# EAGLE design miniDCU (EAGLE 9.6.2)
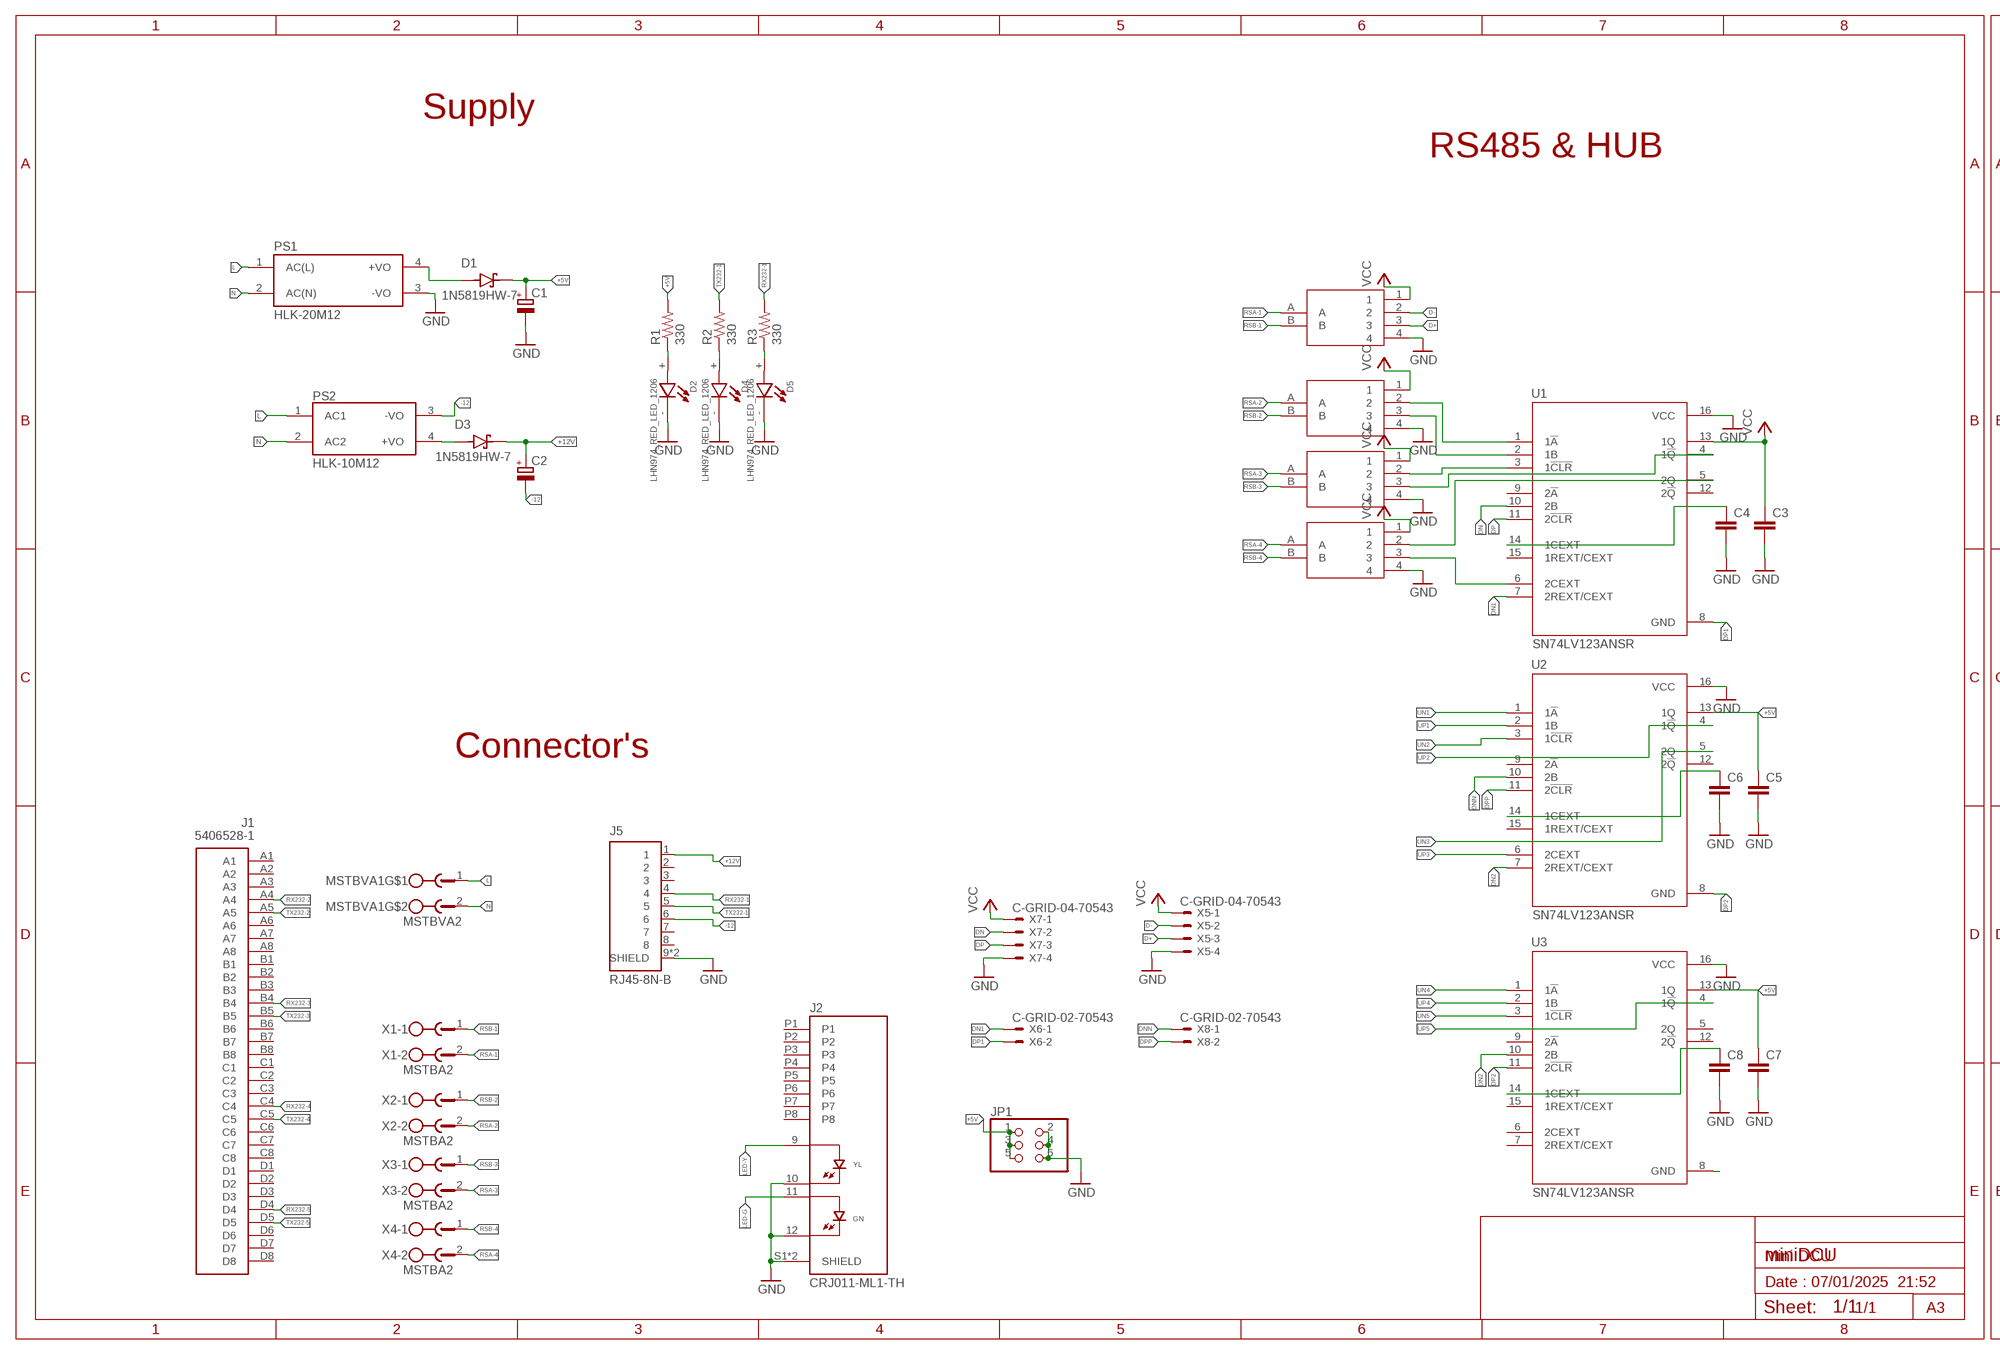
[diagram p0: schematic, sheet 1, part 1 of 2]
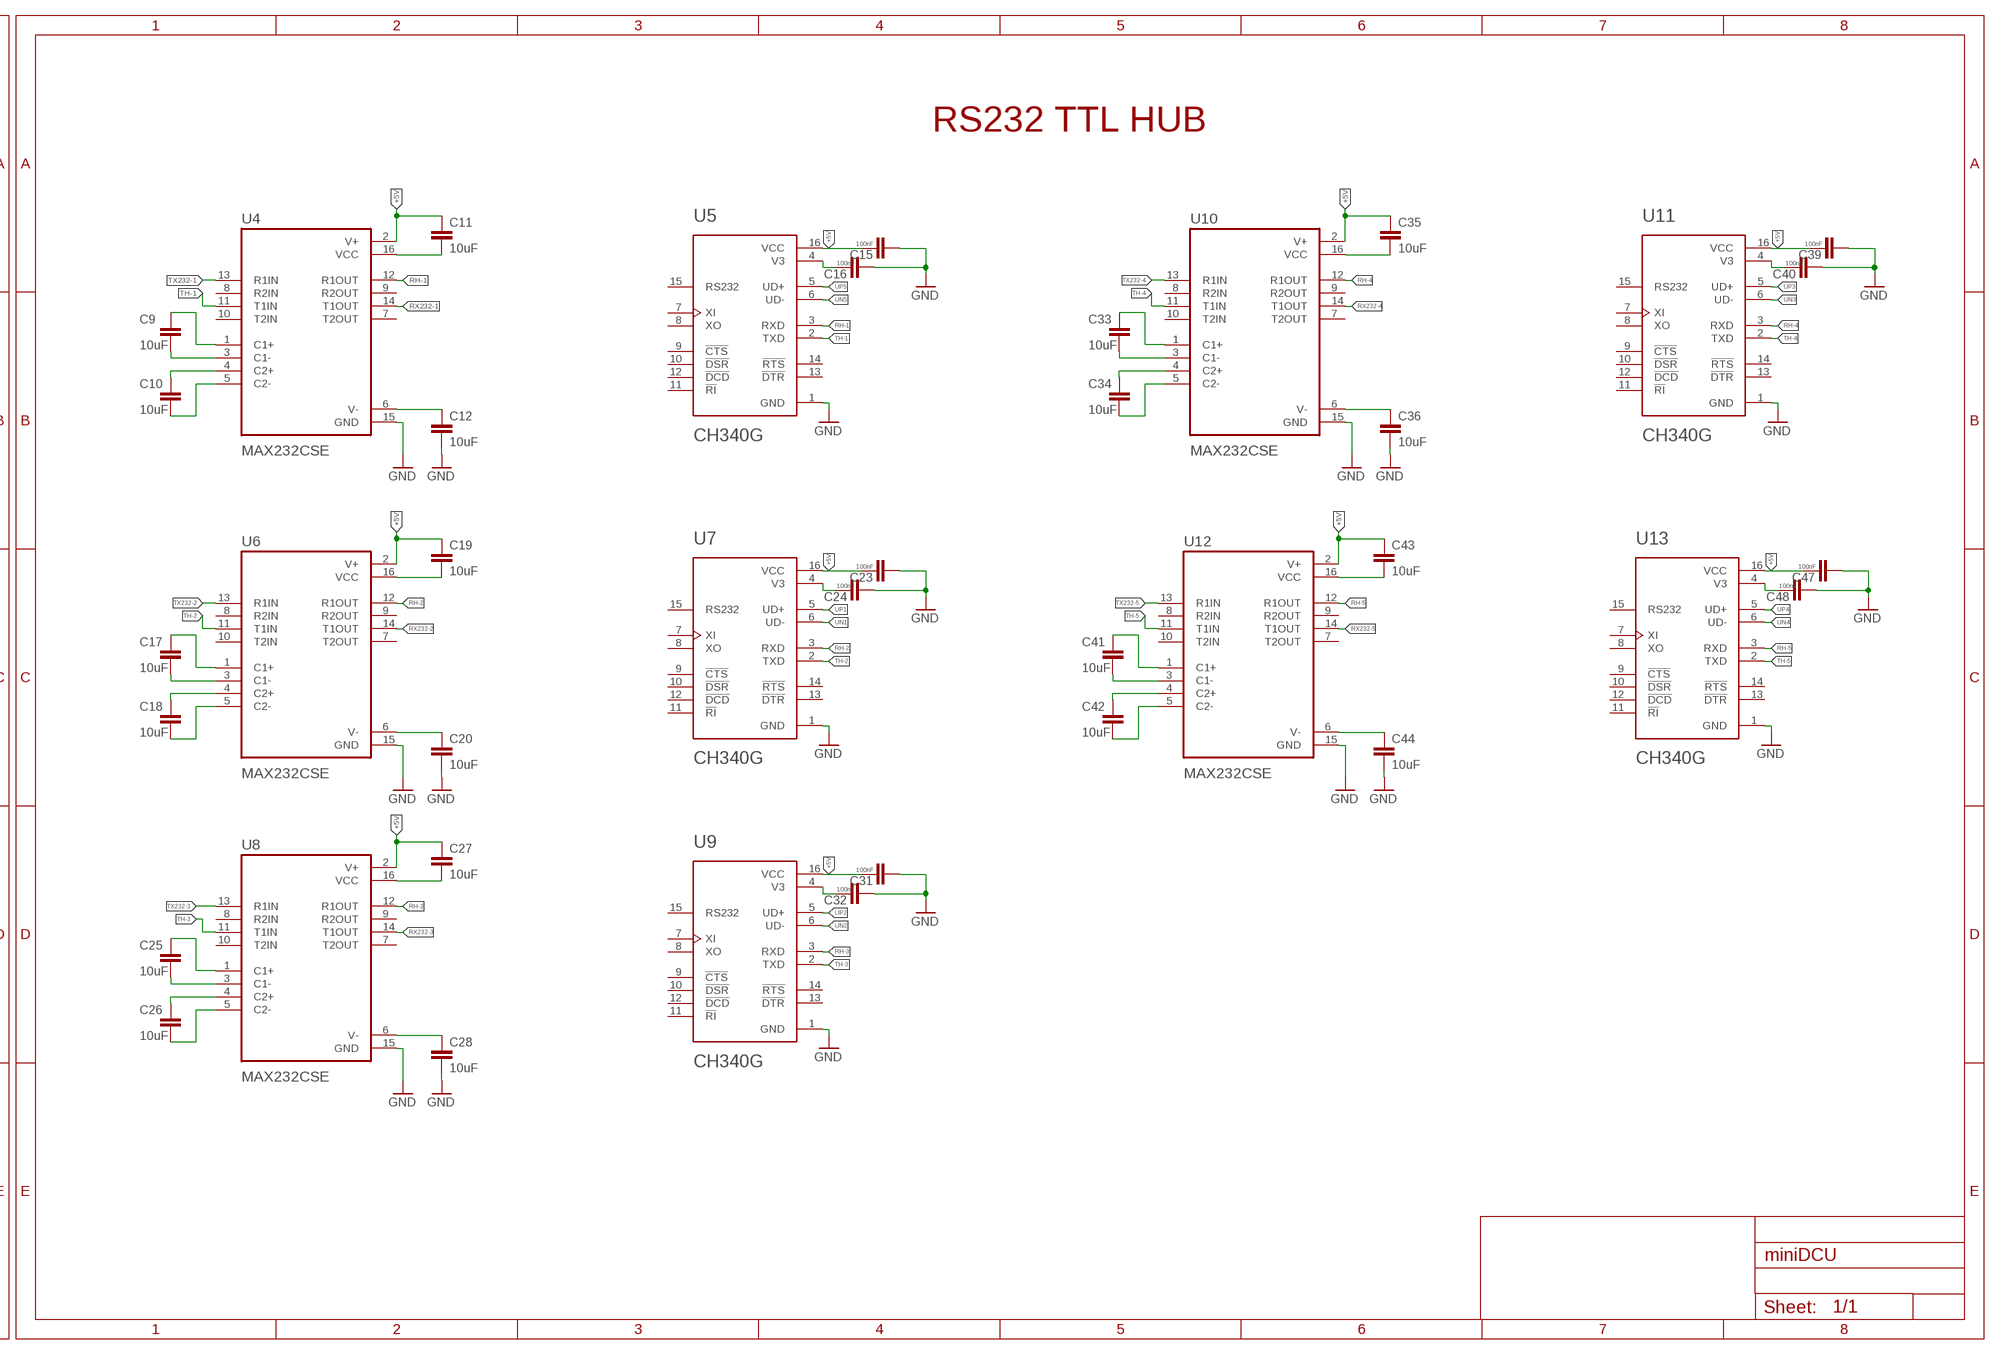
[diagram p1: schematic, sheet 1, part 2 of 2]

## Parts
C1  CPOL-EU153CLV-0505  [153CLV-0505]
C2  CPOL-EU153CLV-0505  [153CLV-0505]
C3  C-EUC0603K  [C0603K]
C4  C-EUC0603K  [C0603K]
C5  C-EUC0603K  [C0603K]
C6  C-EUC0603K  [C0603K]
C7  C-EUC0603K  [C0603K]
C8  C-EUC0603K  [C0603K]
C9  10uF  C-EUC0805  [C0805]
C10  10uF  C-EUC0805  [C0805]
C11  10uF  C-EUC0805  [C0805]
C12  10uF  C-EUC0805  [C0805]
C15  100nF  C-EUC0805K  [C0805K]
C16  100nF  C-EUC0805K  [C0805K]
C17  10uF  C-EUC0805  [C0805]
C18  10uF  C-EUC0805  [C0805]
C19  10uF  C-EUC0805  [C0805]
C20  10uF  C-EUC0805  [C0805]
C23  100nF  C-EUC0805K  [C0805K]
C24  100nF  C-EUC0805K  [C0805K]
C25  10uF  C-EUC0805  [C0805]
C26  10uF  C-EUC0805  [C0805]
C27  10uF  C-EUC0805  [C0805]
C28  10uF  C-EUC0805  [C0805]
C31  100nF  C-EUC0805K  [C0805K]
C32  100nF  C-EUC0805K  [C0805K]
C33  10uF  C-EUC0805  [C0805]
C34  10uF  C-EUC0805  [C0805]
C35  10uF  C-EUC0805  [C0805]
C36  10uF  C-EUC0805  [C0805]
C39  100nF  C-EUC0805K  [C0805K]
C40  100nF  C-EUC0805K  [C0805K]
C41  10uF  C-EUC0805  [C0805]
C42  10uF  C-EUC0805  [C0805]
C43  10uF  C-EUC0805  [C0805]
C44  10uF  C-EUC0805  [C0805]
C47  100nF  C-EUC0805K  [C0805K]
C48  100nF  C-EUC0805K  [C0805K]
D1  1N5819HW-7  [SOD3715X145N]
D2  LHN974_RED_LED_1206  [LEDC3216X120N]
D3  1N5819HW-7  [SOD3715X145N]
D4  LHN974_RED_LED_1206  [LEDC3216X120N]
D5  LHN974_RED_LED_1206  [LEDC3216X120N]
J1  5406528-1  [5406528-1]
J2  CRJ011-ML1-TH  [CUI_CRJ011-ML1-TH]
J5  RJ45-8N-B  [TE_RJ45-8N-B]
JP1  PINHD-2X3  [2X03]
MSTBVA1  MSTBVA2  [MSTBVA2]
PS1  HLK-20M12  [CONV_HLK-20M12]
PS2  HLK-10M12  [CONV_HLK-10M12]
R1  330  R-US_M0805  [M0805]
R2  330  R-US_M0805  [M0805]
R3  330  R-US_M0805  [M0805]
U1  SN74LV123ANSR  [SOIC127P780X200-16N]
U2  SN74LV123ANSR  [SOIC127P780X200-16N]
U3  SN74LV123ANSR  [SOIC127P780X200-16N]
U4  MAX232CSE  [SOIC127P600X175-16N]
U5  CH340G  [SOIC127P600X180-16N]
U6  MAX232CSE  [SOIC127P600X175-16N]
U7  CH340G  [SOIC127P600X180-16N]
U8  MAX232CSE  [SOIC127P600X175-16N]
U9  CH340G  [SOIC127P600X180-16N]
U10  MAX232CSE  [SOIC127P600X175-16N]
U11  CH340G  [SOIC127P600X180-16N]
U12  MAX232CSE  [SOIC127P600X175-16N]
U13  CH340G  [SOIC127P600X180-16N]
USB2RS1  USB2RS485  [USB2RS485]
USB2RS2  USB2RS485  [USB2RS485]
USB2RS3  USB2RS485  [USB2RS485]
USB2RS5  USB2RS485  [USB2RS485]
X1  MSTBA2  [MSTBA2]
X2  MSTBA2  [MSTBA2]
X3  MSTBA2  [MSTBA2]
X4  MSTBA2  [MSTBA2]
X5  C-GRID-04-70543  [70543-04]
X6  C-GRID-02-70543  [70543-02]
X7  C-GRID-04-70543  [70543-04]
X8  C-GRID-02-70543  [70543-02]

## Nets
+5V: C1.+ C5.1 C7.1 C11.1 C15.1 C19.1 C23.1 C27.1 C31.1 C35.1 C39.1 C43.1 C47.1 D1.C(K) JP1.1 JP1.3 JP1.5 R1.2 U2.13(1Q) U3.13(1Q) U4.2(V+) U5.16(VCC) U6.2(V+) U7.16(VCC) U8.2(V+) U9.16(VCC) U10.2(V+) U11.16(VCC) U12.2(V+) U13.16(VCC)
+12V: C2.+ D3.C(K) J5.1
-12: C2.- J5.6 PS2.3(-VO)
D+: USB2RS5.3 X5.3
D-: USB2RS5.2 X5.2
DN: U1.10(2B) X7.2
DN1: U1.7(2REXT/CEXT) X6.1
DN2: U2.7(2REXT/CEXT) U3.10(2B)
DNN: U2.10(2B) X8.1
DP: U1.11(2!CLR) X7.3
DP1: U1.8(GND) X6.2
DP2: U2.8(GND) U3.11(2!CLR)
DPP: U2.11(2!CLR) X8.2
GND: C1.- C3.2 C4.2 C5.2 C6.2 C7.2 C8.2 C12.2 C15.2 C16.2 C20.2 C23.2 C24.2 C28.2 C31.2 C32.2 C36.2 C39.2 C40.2 C44.2 C47.2 C48.2 D2.- D4.- D5.- J2.10 J2.12 J2.S1(SHIELD) J2.S2(SHIELD) J5.9(SHIELD) J5.10(SHIELD) JP1.2 JP1.4 JP1.6 PS1.3(-VO) U1.16(VCC) U2.16(VCC) U3.16(VCC) U4.15(GND) U5.1(GND) U6.15(GND) U7.1(GND) U8.15(GND) U9.1(GND) U10.15(GND) U11.1(GND) U12.15(GND) U13.1(GND) USB2RS1.4 USB2RS2.4 USB2RS3.4 USB2RS5.4 X5.4 X7.4
L: MSTBVA1.1 PS1.1(AC(L)) PS2.1(AC1)
LED-G: J2.11
LED-Y: J2.9
N: MSTBVA1.2 PS1.2(AC(N)) PS2.2(AC2)
N$1: D1.A PS1.4(+VO)
N$2: D4.+ R2.1
N$3: D2.+ R1.1
N$4: D5.+ R3.1
N$8: D3.A PS2.4(+VO)
N$13: U3.8(GND)
N$14: C9.2 U4.3(C1-)
N$15: C9.1 U4.1(C1+)
N$16: C10.1 U4.4(C2+)
N$17: C10.2 U4.5(C2-)
N$18: C11.2 U4.16(VCC)
N$19: C12.1 U4.6(V-)
N$21: U1.1(1!A) USB2RS1.2
N$22: U1.2(1B) USB2RS1.3
N$23: U1.3(1!CLR) USB2RS2.2
N$24: U1.4(1!Q) USB2RS2.3
N$25: U1.5(2Q) USB2RS3.2
N$26: U1.6(2CEXT) USB2RS3.3
N$27: C16.1 U5.4(V3)
N$29: C17.2 U6.3(C1-)
N$30: C17.1 U6.1(C1+)
N$31: C18.1 U6.4(C2+)
N$32: C18.2 U6.5(C2-)
N$33: C19.2 U6.16(VCC)
N$34: C20.1 U6.6(V-)
N$39: C24.1 U7.4(V3)
N$41: C25.2 U8.3(C1-)
N$42: C25.1 U8.1(C1+)
N$43: C26.1 U8.4(C2+)
N$44: C26.2 U8.5(C2-)
N$45: C27.2 U8.16(VCC)
N$46: C28.1 U8.6(V-)
N$49: C32.1 U9.4(V3)
N$51: C33.2 U10.3(C1-)
N$52: C33.1 U10.1(C1+)
N$53: C34.1 U10.4(C2+)
N$54: C4.1 U1.14(1CEXT)
N$55: C8.1 U3.14(1CEXT)
N$56: C34.2 U10.5(C2-)
N$57: C35.2 U10.16(VCC)
N$58: C36.1 U10.6(V-)
N$61: C6.1 U2.14(1CEXT)
N$62: C40.1 U11.4(V3)
N$64: C41.2 U12.3(C1-)
N$65: C41.1 U12.1(C1+)
N$66: C42.1 U12.4(C2+)
N$67: C42.2 U12.5(C2-)
N$68: C43.2 U12.16(VCC)
N$69: C44.1 U12.6(V-)
N$72: C48.1 U13.4(V3)
RH-1: U4.12(R1OUT) U5.3(RXD)
RH-2: U6.12(R1OUT) U7.3(RXD)
RH-3: U8.12(R1OUT) U9.3(RXD)
RH-4: U10.12(R1OUT) U11.3(RXD)
RH-5: U12.12(R1OUT) U13.3(RXD)
RSA-1: USB2RS5.A X1.2
RSA-2: USB2RS1.A X2.2
RSA-3: USB2RS2.A X3.2
RSA-4: USB2RS3.A X4.2
RSB-1: USB2RS5.B X1.1
RSB-2: USB2RS1.B X2.1
RSB-3: USB2RS2.B X3.1
RSB-4: USB2RS3.B X4.1
RX232-1: J5.4 R3.2 U4.14(T1OUT)
RX232-2: J1.A4 U6.14(T1OUT)
RX232-3: J1.B4 U8.14(T1OUT)
RX232-4: J1.C4 U10.14(T1OUT)
RX232-5: J1.D4 U12.14(T1OUT)
TH-1: U4.11(T1IN) U5.2(TXD)
TH-2: U6.11(T1IN) U7.2(TXD)
TH-3: U8.11(T1IN) U9.2(TXD)
TH-4: U10.11(T1IN) U11.2(TXD)
TH-5: U12.11(T1IN) U13.2(TXD)
TX232-1: J5.5 R2.2 U4.13(R1IN)
TX232-2: J1.A5 U6.13(R1IN)
TX232-3: J1.B5 U8.13(R1IN)
TX232-4: J1.C5 U10.13(R1IN)
TX232-5: J1.D5 U12.13(R1IN)
UN1: U2.1(1!A) U7.6(UD-)
UN2: U2.3(1!CLR) U9.6(UD-)
UN3: U2.5(2Q) U11.6(UD-)
UN4: U3.1(1!A) U13.6(UD-)
UN5: U3.3(1!CLR) U5.6(UD-)
UP1: U2.2(1B) U7.5(UD+)
UP2: U2.4(1!Q) U9.5(UD+)
UP3: U2.6(2CEXT) U11.5(UD+)
UP4: U3.2(1B) U13.5(UD+)
UP5: U3.4(1!Q) U5.5(UD+)
VCC: C3.1 U1.13(1Q) USB2RS1.1 USB2RS2.1 USB2RS3.1 USB2RS5.1 X5.1 X7.1
Unconnected: J1.A1 J1.A2 J1.A3 J1.A6 J1.A7 J1.A8 J1.B1 J1.B2 J1.B3 J1.B6 J1.B7 J1.B8 J1.C1 J1.C2 J1.C3 J1.C6 J1.C7 J1.C8 J1.D1 J1.D2 J1.D3 J1.D6 J1.D7 J1.D8 J2.P1 J2.P2 J2.P3 J2.P4 J2.P5 J2.P6 J2.P7 J2.P8 J5.2 J5.3 J5.7 J5.8 U1.9(2!A) U1.12(2!Q) U1.15(1REXT/CEXT) U2.9(2!A) U2.12(2!Q) U2.15(1REXT/CEXT) U3.5(2Q) U3.6(2CEXT) U3.7(2REXT/CEXT) U3.9(2!A) U3.12(2!Q) U3.15(1REXT/CEXT) U4.7(T2OUT) U4.8(R2IN) U4.9(R2OUT) U4.10(T2IN) U5.7(XI) U5.8(XO) U5.9(!CTS) U5.10(!DSR) U5.11(!RI) U5.12(!DCD) U5.13(!DTR) U5.14(!RTS) U5.15(RS232) U6.7(T2OUT) U6.8(R2IN) U6.9(R2OUT) U6.10(T2IN) U7.7(XI) U7.8(XO) U7.9(!CTS) U7.10(!DSR) U7.11(!RI) U7.12(!DCD) U7.13(!DTR) U7.14(!RTS) U7.15(RS232) U8.7(T2OUT) U8.8(R2IN) U8.9(R2OUT) U8.10(T2IN) U9.7(XI) U9.8(XO) U9.9(!CTS) U9.10(!DSR) U9.11(!RI) U9.12(!DCD) U9.13(!DTR) U9.14(!RTS) U9.15(RS232) U10.7(T2OUT) U10.8(R2IN) U10.9(R2OUT) U10.10(T2IN) U11.7(XI) U11.8(XO) U11.9(!CTS) U11.10(!DSR) U11.11(!RI) U11.12(!DCD) U11.13(!DTR) U11.14(!RTS) U11.15(RS232) U12.7(T2OUT) U12.8(R2IN) U12.9(R2OUT) U12.10(T2IN) U13.7(XI) U13.8(XO) U13.9(!CTS) U13.10(!DSR) U13.11(!RI) U13.12(!DCD) U13.13(!DTR) U13.14(!RTS) U13.15(RS232)

## Notes on the sheet
- Supply
- RS232 TTL HUB
- RS485 & HUB
- Connector's
- Mini DCU
- Date : 07/01/2025  21:52
- 1/1 | A3

## Library data of the parts
C1 C2 = rcl:CPOL-EU: POLARIZED CAPACITOR, European symbol; SPICEPREFIX: C
C3-C12 C15-C20 C23-C28 C31-C36 C39-C44 C47 C48 = rcl:C-EU: CAPACITOR, European symbol; SPICEPREFIX: C
D1 D3 = 1N5819HW-7:1N5819HW-7: 1N5819HW Series 40 V 1 A Surface Mount Schottky Barrier Rectifier - SOD-123 Check availability <https://pricing.snapeda.com/parts/1N5819HW-7/Diodes%20Inc./view-part?ref=eda>; AVAILABILITY: In Stock; DESCRIPTION: Diode Schottky 40 V 1A Surface Mount SOD-123; MF: Diodes Inc.; MP: 1N5819HW-7; PACKAGE: SOD-123 Fairchild Semiconductor; PRICE: None; PURCHASE-URL: https://pricing.snapeda.com/search/part/1N5819HW-7/?ref=eda
D2 D4 D5 = LHN974_RED_LED_1206:LHN974_RED_LED_1206: Check availability <https://pricing.snapeda.com/parts/LHN974%20RED%20LED%201206/Osram/view-part?ref=eda>; AVAILABILITY: Not in stock; CHECK_PRICES: https://www.snapeda.com/parts/LHN974%20RED%20LED%201206/Osram/view-part/?ref=eda; DESCRIPTION: 2.6 V Red LED SMD; MF: Osram; MP: LHN974 RED LED 1206; PACKAGE: None; PRICE: None; SNAPEDA_LINK: https://www.snapeda.com/parts/LHN974%20RED%20LED%201206/Osram/view-part/?ref=snap
J1 = 1x4-rj45:5406528-1: https://www.mouser.com/ProductDetail/TE-Connectivity/5406528-1?qs=%2Fha2pyFaduhW1yoX2fqnO8wde0gPlB9ihmIbWroxuIA%3D Check availability <https://pricing.snapeda.com/parts/5406528-1/TE%20Connectivity/view-part?ref=eda>; AVAILABILITY: In Stock; CHECK_PRICES: https://www.snapeda.com/parts/5406528-1/TE+Connectivity+AMP+Connectors/view-part/?ref=eda; COMMENT: 5406528-1; DESCRIPTION: Conn RJ-45 F 32 POS 2.04mm Solder RA Thru-Hole 32 Terminal 4 Port Tray Cat 5; EU_ROHS_COMPLIANCE: Compliant; MF: TE Connectivity; MP: 5406528-1; PACKAGE: None; PRICE: None; SNAPEDA_LINK: https://www.snapeda.com/parts/5406528-1/TE+Connectivity+AMP+Connectors/view-part/?ref=snap
J2 = CRJ011-ML1-TH:CRJ011-ML1-TH: Check availability <https://pricing.snapeda.com/parts/CRJ011-ML1-TH/Same%20Sky/view-part?ref=eda>; AVAILABILITY: In Stock; CHECK_PRICES: https://www.snapeda.com/parts/CRJ011-ML1-TH/Same+Sky/view-part/?ref=eda; DESCRIPTION: 10/100 BaseT, 8P8C, Horizontal, Shielded, LED, Through Hole, 6 µin Plating, RJ45 with Integrated Magnetics Modular Connector; MF: Same Sky; MP: CRJ011-ML1-TH; PACKAGE: None; PRICE: None; SNAPEDA_LINK: https://www.snapeda.com/parts/CRJ011-ML1-TH/Same+Sky/view-part/?ref=snap
J5 = RJ45-8N-B:RJ45-8N-B: RJ Jack / Signal Line EMI/RFI Filters 6 TERM LOW PROFILE BLOCK INDUCTOR 8 PIN Check availability <https://pricing.snapeda.com/parts/RJ45-8N-B/TE%20Connectivity/view-part?ref=eda>; AVAILABILITY: In Stock; DESCRIPTION: Jack Modular Connector 8p8c (RJ45, Ethernet) 90° Angle (Right) Unshielded -; MF: TE Connectivity; MP: RJ45-8N-B; PACKAGE: None; PRICE: None; PURCHASE-URL: https://pricing.snapeda.com/search/part/RJ45-8N-B/?ref=eda
JP1 = pinhead:PINHD-2X3: PIN HEADER
MSTBVA1 = con-phoenix-508:MSTBVA2
PS1 = HLK-20M12:HLK-20M12: Check availability <https://pricing.snapeda.com/parts/HLK-20M12/Hi-link/view-part?ref=eda>; AVAILABILITY: Not in stock; CHECK_PRICES: https://www.snapeda.com/parts/HLK-20M12/Hi-link/view-part/?ref=eda; DESCRIPTION: 20W ultra-small series module power supply; MF: Hi-link; MP: HLK-20M12; PACKAGE: Non-Standard Hi-link; PRICE: None; SNAPEDA_LINK: https://www.snapeda.com/parts/HLK-20M12/Hi-link/view-part/?ref=snap
PS2 = HLK-10M12:HLK-10M12: Check availability <https://pricing.snapeda.com/parts/HLK-10M12/Hi-link/view-part?ref=eda>; AVAILABILITY: Not in stock; CHECK_PRICES: https://www.snapeda.com/parts/HLK-10M12/Hi-link/view-part/?ref=eda; DESCRIPTION: 10W Ultra-Compact Power Module; MF: Hi-link; MP: HLK-10M12; PACKAGE: Package; PRICE: None; SNAPEDA_LINK: https://www.snapeda.com/parts/HLK-10M12/Hi-link/view-part/?ref=snap
R1-R3 = adafruit:R-US_: RESISTOR, American symbol
U1-U3 = SN74LV123ANSR:SN74LV123ANSR: Monostable Multivibrator 13ns 16-SO; CHECK_PRICES: https://www.snapeda.com/parts/SN74LV123ANSR/Texas+Instruments/view-part/?ref=eda; DESCRIPTION: Dual Retriggerable Monostable Multivibrators; DIGIKEY_PART_NUMBER: 296-46201-2-ND; MF: Texas Instruments; MP: SN74LV123ANSR; PACKAGE: SOP-16 Texas Instruments; SNAPEDA_LINK: https://www.snapeda.com/parts/SN74LV123ANSR/Texas+Instruments/view-part/?ref=snap
U4 U6 U8 U10 U12 = MAX232CSE:MAX232CSE: Check availability <https://pricing.snapeda.com/parts/MAX232CSE/Maxim%20Integrated/view-part?ref=eda>; AVAILABILITY: In Stock; DESCRIPTION: 2/2 Transceiver Full RS232 16-SOIC; MF: Maxim Integrated; MP: MAX232CSE; PACKAGE: SOIC-16 Maxim Integrated; PRICE: None; PURCHASE-URL: https://pricing.snapeda.com/search/part/MAX232CSE/?ref=eda
U5 U7 U9 U11 U13 = CH340G:CH340G: Check availability <https://pricing.snapeda.com/parts/Ch340G/WCH/view-part?ref=eda>; AVAILABILITY: Not in stock; DESCRIPTION: USB Interface Integrated Circuit; MF: WCH; MP: Ch340G; PACKAGE: None; PRICE: None
USB2RS1-USB2RS3 USB2RS5 = USB2RS485:USB2RS485
X1-X4 = con-phoenix-508:MSTBA2: PHOENIX; MF: FARNELL; MPN: 1757242; OC_FARNELL: 3705171; OC_NEWARK: 71C4161
X5 X7 = con-molex:C-GRID-04: CONNECTOR wire to board 2.54 mm (0.100") pitch header; MF: MOLEX; OC_FARNELL: unknown; OC_NEWARK: unknown
X6 X8 = con-molex:C-GRID-02: CONNECTOR wire to board 2.54 mm (0.100") pitch header; MF: MOLEX; OC_FARNELL: unknown; OC_NEWARK: unknown

## Board
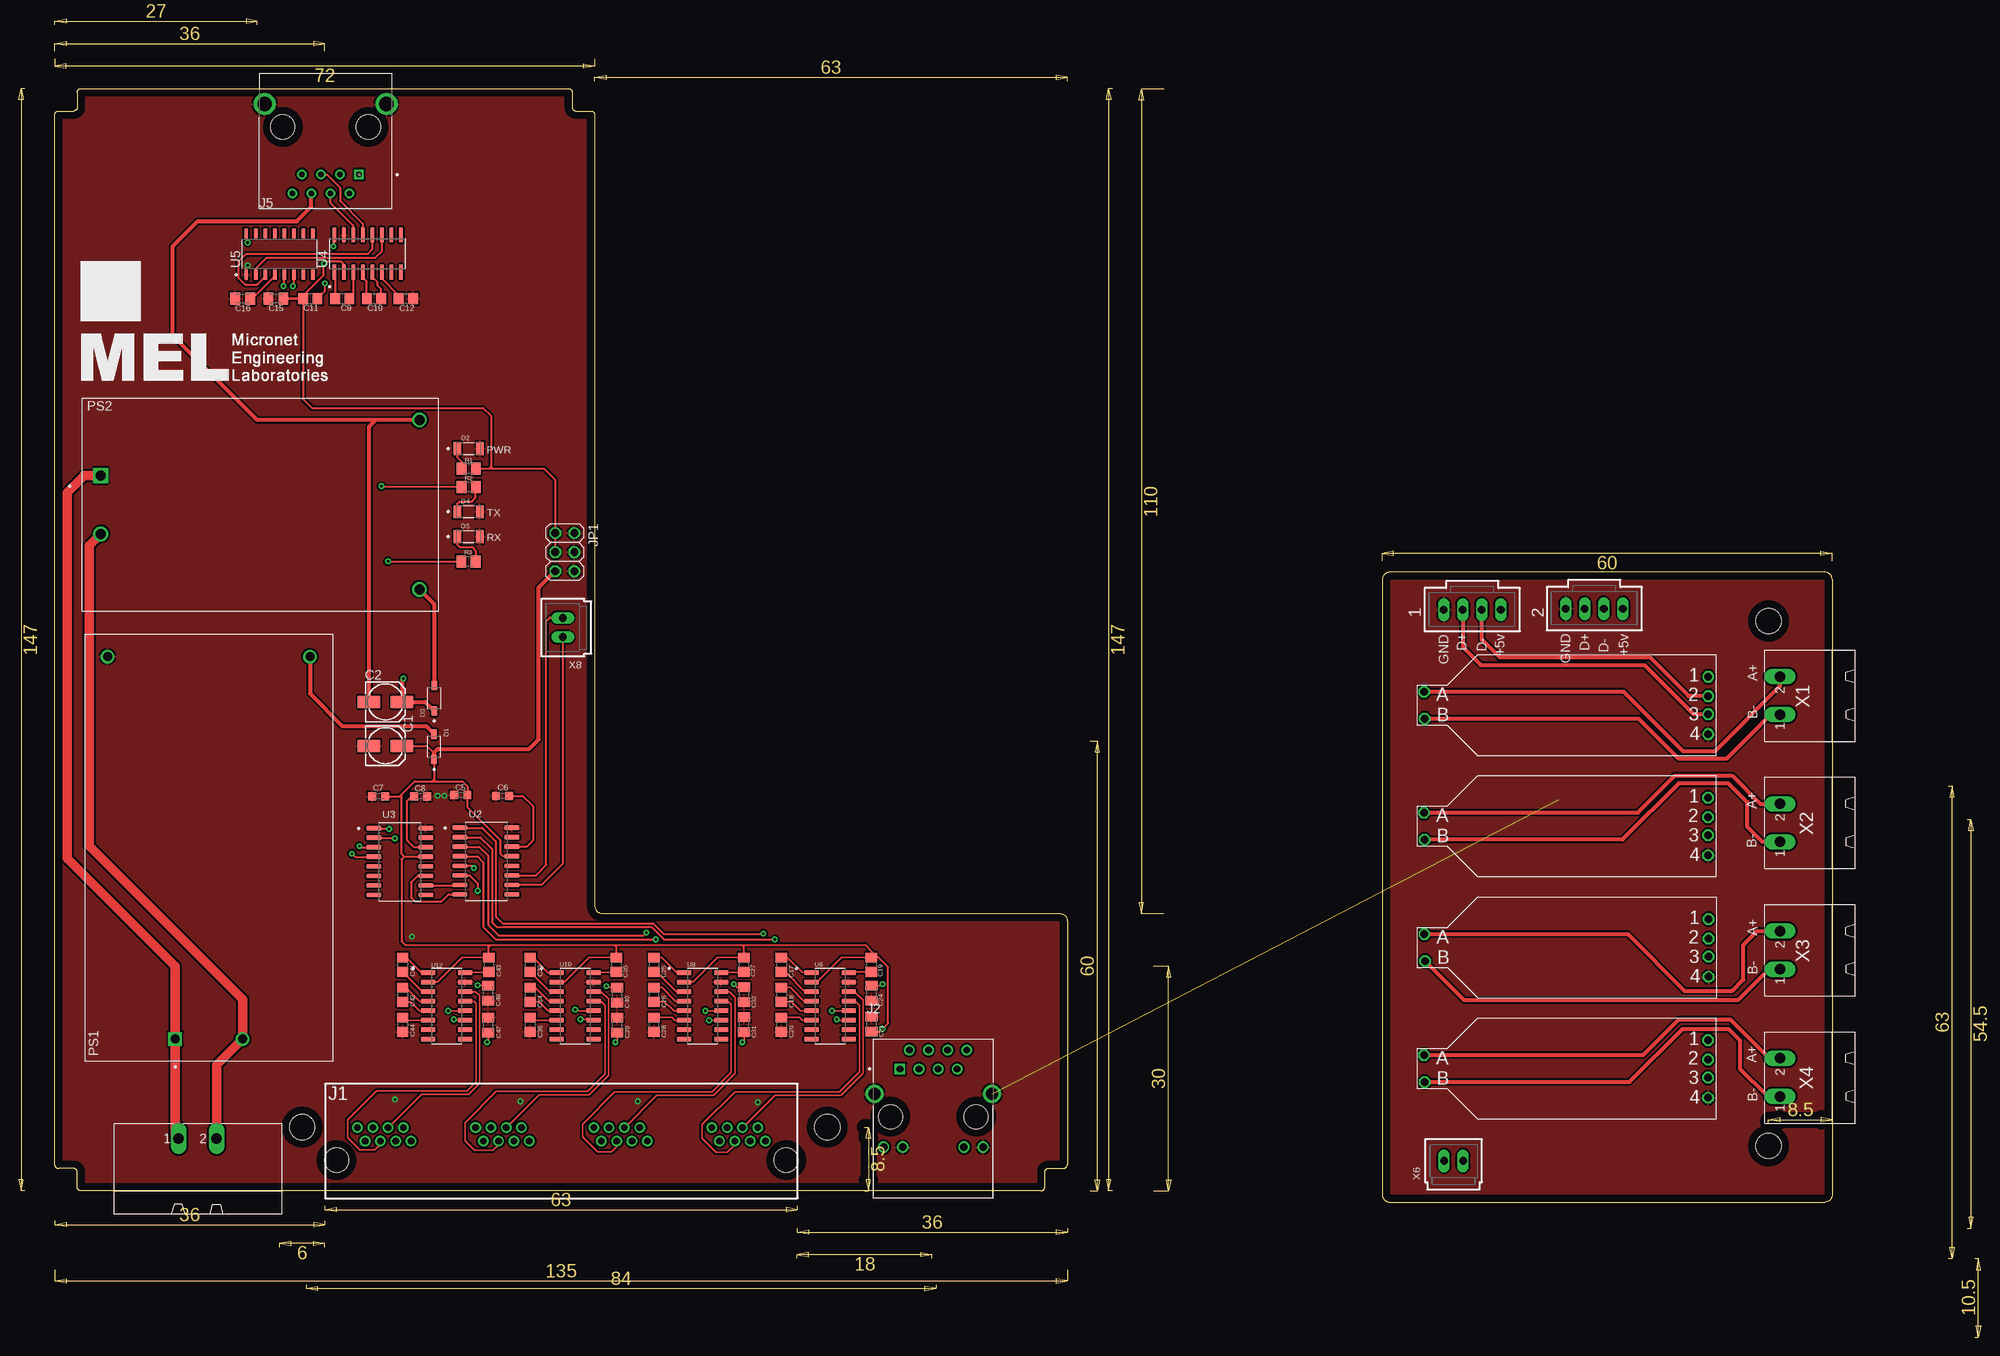
[diagram p2: board, top side]
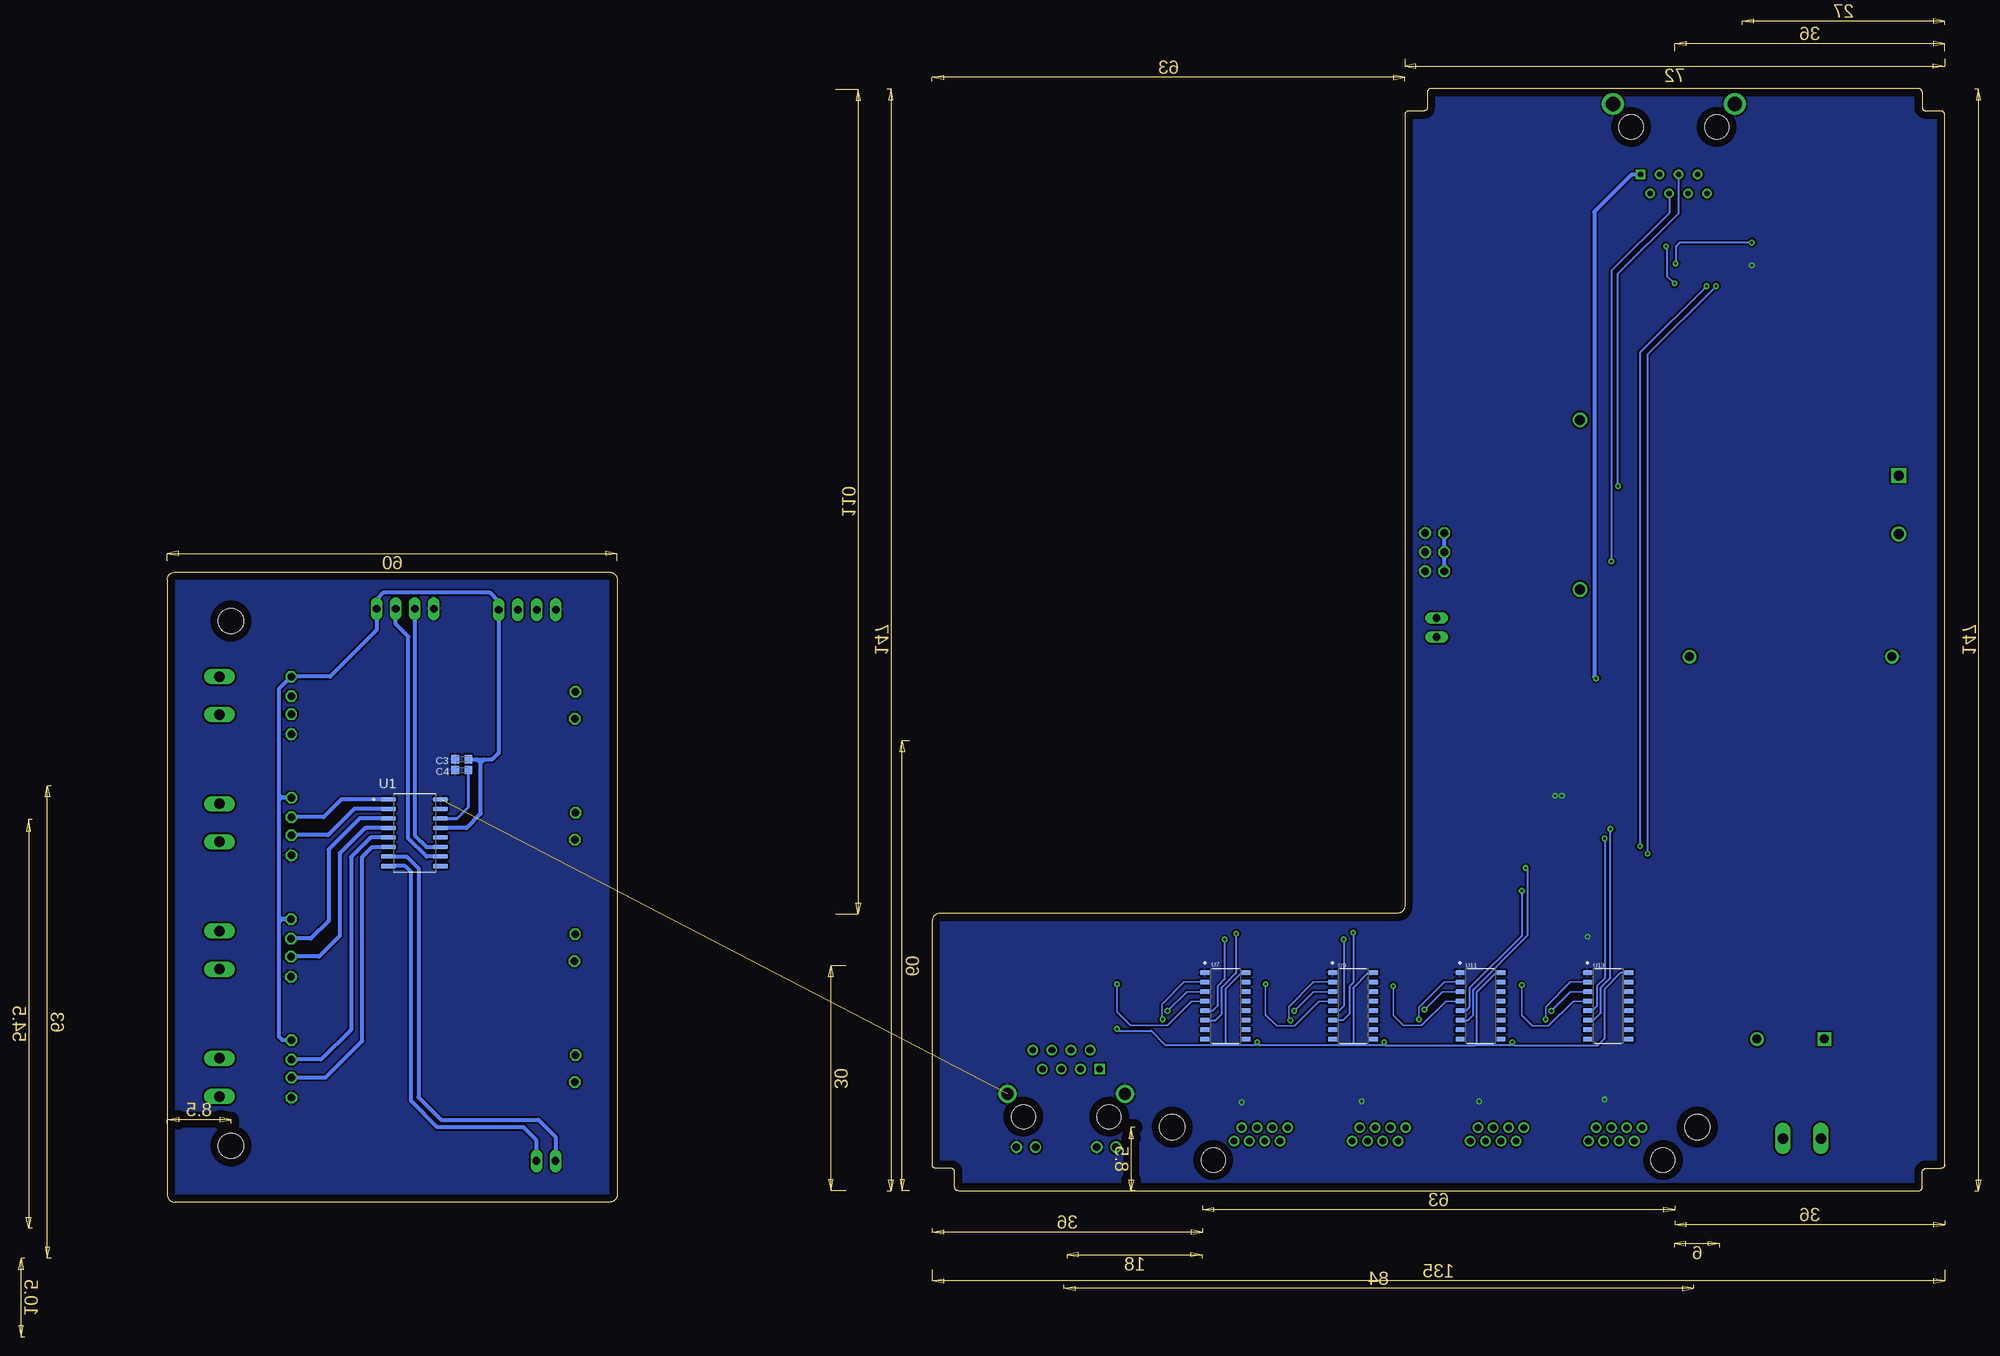
[diagram p3: board, bottom side, seen from below]

Size 237 x 148.5 mm. Coordinates in mm from the lower left corner, seen from the top.
Outline: 237,83 237,1 arc-90 236,0 178,0 arc-90 177,1 177,83 arc-90 178,84 236,84 arc-90 237,83
Outline: 0,5 0,145 arc-90 0.5,145.5 2.5,145.5 arc90 3,146 3,148 arc-90 3.5,148.5 68.5,148.5 arc-90 69,148 69,146 arc90 69.5,145.5 71.5,145.5 arc-90 72,145 72,39.5 arc90 73,38.5 134,38.5 arc-90 135,37.5 135,5 arc-90 134.5,4.5 132.5,4.5 arc90 132,4 132,2 arc-90 131.5,1.5 3.5,1.5 arc-90 3,2 3,4 arc90 2.5,4.5 0.5,4.5 arc-90 0,5
Copper layers (1*16): Top 0.035mm / dielectric 1.5mm / Bottom 0.035mm
Design rules "miniDCU *": minimum track width 6mil, minimum drill 0.35mm, track to track 10mil, track to pad 10mil, pad to pad 0.205mm, via to via 0.205mm, smd to smd 6mil, copper to edge 40mil, drill to drill 6mil, minimum pad ring 10mil, minimum via ring 8mil, stop-mask expansion 4mil, vias tented up to drill 0mil, thermal gap 10mil
Holes 3.4 mm at 33,10 103,10 228.5,7.5 228.5,77.5

### Footprints (pad centres in the part's own frame; a part is rotated, then mirrored left to right if it is on the bottom)
153CLV-0505 = smd 3 x 1.6: + 2.2,0; - -2.2,0
C0603K = smd 1.05 x 1.08: 1 -0.875,0; 2 0.875,0
C0805 = smd 1.3 x 1.5: 1 -0.95,0; 2 0.95,0
C0805K = smd 1.3 x 1.6: 1 -1,0; 2 1,0
SOD3715X145N = smd 1.21 x 0.73: A 1.68,0; C -1.68,0
LEDC3216X120N = smd 1.01 x 1.73: + -1.51,0; - 1.51,0
5406528-1 = drill 0.9 pad 1.3: A1 27.21,7.62; A2 26.19,9.4; A3 25.17,7.62; A4 24.15,9.4; A5 23.13,7.62; A6 22.11,9.4; A7 21.09,7.62; A8 20.07,9.4; B1 11.46,7.62; B2 10.44,9.4; B3 9.42,7.62; B4 8.4,9.4; B5 7.38,7.62; B6 6.36,9.4; B7 5.34,7.62; B8 4.32,9.4; C1 -4.29,7.62; C2 -5.31,9.4; C3 -6.33,7.62; C4 -7.35,9.4; C5 -8.37,7.62; C6 -9.39,9.4; C7 -10.41,7.62; C8 -11.43,9.4; D1 -20.04,7.62; D2 -21.06,9.4; D3 -22.08,7.62; D4 -23.1,9.4; D5 -24.12,7.62; D6 -25.14,9.4; D7 -26.16,7.62; D8 -27.18,9.4 | hole 3.25: -29.97,5.08; 29.97,5.08
CUI_CRJ011-ML1-TH = drill 1: 9 -6.63,-4.06; 10 -4.09,-4.06; 11 4.09,-4.06; 12 6.63,-4.06 | drill 0.9 square: P1 -4.445,6.35 | drill 0.9: P2 -3.175,8.89; P3 -1.905,6.35; P4 -0.635,8.89; P5 0.635,6.35; P6 1.905,8.89; P7 3.175,6.35; P8 4.445,8.89 | drill 1.6: S1 -7.815,3.05; S2 7.815,3.05 | hole 3.25: -5.715,0; 5.715,0
TE_RJ45-8N-B = drill 0.76 square: 1 -4.445,6.35 | drill 0.76: 2 -3.175,8.89; 3 -1.905,6.35; 4 -0.635,8.89; 5 0.635,6.35; 6 1.905,8.89; 7 3.175,6.35; 8 4.445,8.89 | drill 1.93: 9 -8.125,-3.05; 10 8.125,-3.05 | hole 3.25: -5.715,0; 5.715,0
2X03 = drill 1.016 octagon: 1 -2.54,-1.27; 2 -2.54,1.27; 3 0,-1.27; 4 0,1.27; 5 2.54,-1.27; 6 2.54,1.27
MSTBVA2 = drill 1.397 long: 1 -2.54,5.08; 2 2.54,5.08
CONV_HLK-20M12 = drill 1.2 square: 1 -25.5,4.5 | drill 1.2: 2 -25.5,-4.5; 3 25.5,13.5; 4 25.5,-13.5
CONV_HLK-10M12 = drill 1.3 square: 1 -21.25,3.9 | drill 1.3: 2 -21.25,-3.9; 3 21.25,11.3; 4 21.25,-11.3
M0805 = smd 1.3 x 1.6: 1 -0.95,0; 2 0.95,0
SOIC127P780X200-16N = smd 1.97 x 0.61: 1 -3.465,4.445; 2 -3.465,3.175; 3 -3.465,1.905; 4 -3.465,0.635; 5 -3.465,-0.635; 6 -3.465,-1.905; 7 -3.465,-3.175; 8 -3.465,-4.445; 9 3.465,-4.445; 10 3.465,-3.175; 11 3.465,-1.905; 12 3.465,-0.635; 13 3.465,0.635; 14 3.465,1.905; 15 3.465,3.175; 16 3.465,4.445
SOIC127P600X175-16N = smd 1.97 x 0.59: 1 -2.475,4.445; 2 -2.475,3.175; 3 -2.475,1.905; 4 -2.475,0.635; 5 -2.475,-0.635; 6 -2.475,-1.905; 7 -2.475,-3.175; 8 -2.475,-4.445; 9 2.475,-4.445; 10 2.475,-3.175; 11 2.475,-1.905; 12 2.475,-0.635; 13 2.475,0.635; 14 2.475,1.905; 15 2.475,3.175; 16 2.475,4.445
SOIC127P600X180-16N = smd 1.31 x 0.62: 1 -2.75,4.445; 2 -2.75,3.175; 3 -2.75,1.905; 4 -2.75,0.635; 5 -2.75,-0.635; 6 -2.75,-1.905; 7 -2.75,-3.175; 8 -2.75,-4.445; 9 2.75,-4.445; 10 2.75,-3.175; 11 2.75,-1.905; 12 2.75,-0.635; 13 2.75,0.635; 14 2.75,1.905; 15 2.75,3.175; 16 2.75,4.445
USB2RS485 = drill 1 pad 1.422 octagon: 1 36.9,3.6; 2 36.9,1; 3 36.9,-1.4; 4 36.9,-4.1; A -1,1.6; B -0.9,-2
MSTBA2 = drill 1.397 long: 1 -2.54,5.08; 2 2.54,5.08
70543-04 = drill 1.016 long: 1 -3.81,0; 2 -1.27,0; 3 1.27,0; 4 3.81,0
70543-02 = drill 1.016 long: 1 -1.27,0; 2 1.27,0

### Placement (x,y rotation side)
C1  44.1,60.85 0 top
C2  44.09,66.7 0 top
C3  197.73,59.05 180 bottom
C4  197.72,57.61 180 bottom
C5  54.15,54.3 180 top
C6  59.7,54.18 180 top
C7  43.18,54.12 180 top
C8  48.77,54.12 0 top
C9  38.34,120.49 0 top
C10  42.56,120.49 0 top
C11  34.07,120.49 0 top
C12  46.82,120.48 0 top
C15  29.49,120.5 180 top
C16  25.05,120.48 180 top
C17  96.88,31.66 270 top
C18  96.88,27.66 270 top
C19  108.88,31.66 270 top
C20  96.88,23.66 270 top
C23  108.92,23.73 90 top
C24  108.92,27.86 270 top
C25  79.88,31.66 270 top
C26  79.88,27.66 270 top
C27  91.88,31.66 270 top
C28  79.88,23.66 270 top
C31  91.88,23.66 90 top
C32  91.88,27.66 270 top
C33  63.38,31.66 270 top
C34  63.38,27.66 270 top
C35  74.88,31.66 270 top
C36  63.38,23.66 270 top
C39  74.98,23.6 90 top
C40  74.98,27.6 270 top
C41  46.38,31.66 270 top
C42  46.38,27.66 270 top
C43  57.88,31.66 270 top
C44  46.38,23.66 270 top
C47  57.82,23.6 90 top
C48  57.82,27.86 270 top
D1  50.56,60.71 90 top
D2  55.18,100.5 0 top
D3  50.59,67.19 90 top
D4  55.17,92.05 0 top
D5  55.17,88.75 0 top
J1  67.55,0.52 0 top
J2  117.14,11.39 0 top
J5  36.12,143.38 180 top
JP1  67.99,86.68 270 top
MSTBVA1  19.05,3.41 0 top
PS1  20.54,47.25 90 top
PS2  27.39,92.99 0 top
R1  55.19,97.8 0 top
R2  55.2,95.35 180 top
R3  55.17,85.45 180 top
U1  204.03,49.26 0 bottom
U2  57.5,45.48 0 top
U3  45.99,45.41 0 top
U4  41.72,126.49 90 top
U5  29.97,126.43 90 top
U6  103.38,26.16 0 top
U7  95.88,26.16 0 bottom
U8  86.38,26.16 0 top
U9  78.88,26.16 0 bottom
U10  69.38,26.16 0 top
U11  61.88,26.16 0 bottom
U12  52.25,26.16 0 top
U13  44.88,26.16 0 bottom
USB2RS1  183.56,50.33 0 top
USB2RS2  183.62,34.13 0 top
USB2RS3  183.56,18 0 top
USB2RS5  183.57,66.47 0 top
X1  235.11,67.54 90 top
X2  235.11,50.57 90 top
X3  235.11,33.6 90 top
X4  235.11,16.63 90 top
X5  189,79 180 top
X6  186.5,5.5 0 top
X7  205.27,79.14 180 top
X8  67.73,76.62 90 top

### Tracks (layer width: path | path; a pad name or v marks a point on that pad's centre or on a via)
+5V  (via drill 0.35)
  Top 0.2: U6.2 101.62,29.33 104.9,32.61 C19.1 | U8.2 85.11,29.33 88.39,32.61 C27.1 | U10.2 67.97,29.33 71.25,32.61 C35.1 | U12.2 51.08,29.33 54.35,32.61 C43.1
  Top 0.254: C31.1 91.88,21.5 v91.69,21.31 | C39.1 74.98,21.52 v74.77,21.31 | C47.1 57.82,21.47 v57.66,21.31 | C43.1 57.88,34.04 | 58.17,34.27 74.55,34.27 | 74.55,34.27 91.57,34.27 | 91.57,34.27 108.08,34.27 108.88,33.46 C19.1 | C19.1 | C27.1 91.88,33.95 91.57,34.27 | C35.1 74.88,33.93 74.55,34.27 | C23.1 110,22.73 v110.36,23.09 111.12,23.85 111.12,31.34 109.86,32.61 C19.1 | U5.16 25.52,128.14 v25.72,127.95 | U4.2 38.54,125.03 38.16,125.41 36.13,125.41 v35.88,125.15 35.88,123.63 33.12,120.87 C11.1 33.12,107.06 34.29,105.89 57.15,105.89 58.17,104.88 58.17,98.06 | U3.13 46.64,46.05 | 46.23,53.82 46.23,46.46 46.64,46.05 | 46.23,53.82 45.94,54.12 | C7.1 45.94,54.12 | U2.13 59.78,46.11 59.44,46.46 59.44,48.24 55.02,52.65 C5.1 55.02,55.45 54.36,56.11 50.8,56.11 | 45.94,54.12 46.01,54.12 46.23,54.33 | 46.23,54.33 48.01,56.11 50.29,56.11 | 50.29,56.11 50.55,56.11 | 50.55,56.11 50.8,56.11 | 50.55,56.11 50.56,56.12 50.56,56.35 | 50.56,56.35 D1.C 50.56,59.91 49.61,60.85 C1.+ | 50.8,56.11 50.56,56.35 | 50.56,56.35 50.53,56.35 50.29,56.11 | 46.23,53.82 46.23,54.33 | 46.64,46.05 46.58,46.05 46.23,45.7 46.23,34.77 46.74,34.27 57.66,34.27 | 57.66,34.27 57.88,34.04 | 57.66,34.27 58.17,34.27 | 57.88,34.04 57.94,34.04 58.17,34.27 | JP1.3 66.72,96.32 65.24,97.8 58.42,97.8 | R1.2 57.91,97.8 | 57.91,97.8 58.42,97.8 | 58.17,98.06 57.91,97.8 | 58.17,98.06 58.42,97.8
  Top 0.305: C11.1 C15.1
  Top 0.508: D1.C 50.56,59.93 51.05,60.43 63.25,60.43 64.52,61.7 64.52,81.93 JP1.5
  Bottom 0.254: U7.16 93.7,30.6 95.89,28.42 95.89,21.18 | 95.89,21.18 96.14,20.93 | 96.14,20.93 103.89,20.93 105.79,22.84 110.11,22.84 v110.36,23.09 | U9.16 76.81,30.6 78.87,28.55 78.87,21.18 | 79.13,20.92 91.43,20.92 91.69,21.18 | 78.87,21.18 79.13,20.92 | 74.77,21.18 74.5,20.92 | 62.61,20.93 62.36,21.18 | 62.36,21.18 62.36,28.04 59.8,30.6 U11.16 | 74.5,20.92 62.62,20.92 62.61,20.93 | 57.66,21.18 57.4,20.93 | 57.4,20.93 46.23,20.93 45.34,21.82 45.34,28.42 43.16,30.6 U13.16 | 91.69,21.18 91.94,20.93 95.63,20.93 | v91.69,21.31 91.69,21.18 | 95.63,20.93 96.14,20.93 | 95.89,21.18 95.63,20.93 | v74.77,21.31 74.77,21.18 | 74.77,21.18 75.02,20.93 | 78.87,21.18 78.61,20.93 | 75.02,20.93 78.61,20.93 | 78.61,20.93 78.62,20.92 79.13,20.92 | 74.5,20.92 75.01,20.92 75.02,20.93 | v57.66,21.31 57.66,21.18 | 57.91,20.93 57.66,21.18 | 62.1,20.93 62.36,21.18 | 57.91,20.93 62.1,20.93 | 62.1,20.93 62.61,20.93 | 57.4,20.93 57.91,20.93 | v25.72,127.95 35.37,127.95 35.88,127.44 v35.88,125.15
  Bottom 0.508: JP1.5 JP1.3 JP1.1
+12V  (via drill 0.35)
  Top 0.508: D3.C 49.4,66.7 C2.+ 46.3,69.64 v46.48,69.83
  Bottom 0.508: J5.1 41.76,137.03 46.74,132.06 46.74,70.08 v46.48,69.83
-12
  Top 0.508: C2.- 41.9,103.39 42.8,104.29 | PS2.3 42.8,104.29 | 42.8,104.29 27,104.29 15.75,115.55 15.75,127.48 19.05,130.79 32.26,130.79 34.21,132.74 J5.6
D+
  Top 0.508: X5.3 187.73,74 190.12,71.61 211.97,71.61 218.5,65.07 USB2RS5.3
D-
  Top 0.508: USB2RS5.2 217.88,67.47 212.73,72.62 192.66,72.62 190.27,75.01 X5.2
DN
  Bottom 0.508: U1.10 202.44,46.08 204.85,48.49 204.85,75.42 206.54,77.1 X7.2
DN1
  Bottom 0.508: U1.7 205.08,46.08 203.5,44.5 203.5,14 200.5,11 187.5,11 185.23,8.73 X6.1
DN2
  Top 0.254: U3.10 53.97,42.23 U2.7
DNN
  Top 0.254: X8.1 67.73,45.1 64.93,42.3 U2.10
DP
  Bottom 0.508: X7.3 204,48.91 202.44,47.35 U1.11
DP1
  Bottom 0.508: X6.2 187.77,8.27 189.5,10 201,10 204.5,13.5 204.5,44 205.31,44.81 U1.8
DP2
  Top 0.254: U3.11 48.35,43.51 47.5,42.65 47.5,40.62 48.01,40.11 51.56,40.11 52.48,41.03 U2.8
DPP
  Top 0.254: U2.11 64.17,43.57 65.53,44.93 65.53,77.45 66.04,77.95 67.67,77.95 X8.2
GND  (via drill 0.35)  (1 unrouted)
  Top 0.254: U5.1 25.52,124.7 v25.72,124.9
  other vias: 51.05,54.2 47.62,35.41 51.94,54.2 45.34,13.69 62.1,13.44 77.72,13.44 93.73,13.31
  pour Top: 1,1.47 arc-90 0,2.47 0,147.47 arc-90 1,148.47 71.03,148.47 arc-90 72,147.5 72,118.5 arc90 72,118.5 72,39.47 arc90 73,38.47 134,38.47 arc-90 135,37.47 135,2.47 arc-90 134,1.47
  pour Bottom: 1,1.47 arc-90 0,2.47 0,147.47 arc-90 1.01,148.48 71,148.5 arc-90 72,147.5 72,119 72,39.47 arc90 73,38.47 134,38.47 arc-90 135,37.47 135,2.47 arc-90 134,1.47
  pour Bottom: 177,83 arc-90 178,84 236,84 arc-90 237,83 237,1 arc-90 236,0 178,0 arc-90 177,1
  pour Top: 177,83 arc-90 178,84 236,84 arc-90 237,83 237,1 arc-90 236,0 178,0 arc-90 177,1
L
  Top 1.27: MSTBVA1.1 16.04,8.96 PS1.1 16.04,31.43 1.66,45.82 1.66,94.6 3.95,96.89 PS2.1
N
  Top 1.27: MSTBVA1.2 21.59,18.3 PS1.2 25.04,27.01 4.57,47.47 4.57,87.53 PS2.2
N$1
  Top 0.508: PS1.4 34.04,67.79 38.35,63.48 49.53,63.48 50.56,62.45 D1.A
N$2
  Top 0.254: D4.+ 53.66,93.13 53.98,93.45 55.63,93.45 56.15,93.97 R2.1
N$3
  Top 0.254: D2.+ 53.67,99.34 54.24,98.77 R1.1
N$4
  Top 0.254: D5.+ 53.66,87.67 53.98,87.35 55.63,87.35 56.13,86.84 56.13,85.46 R3.1
N$8
  Top 0.508: PS2.4 50.59,79.73 D3.A
N$14
  Top 0.254: U4.3 39.81,121.02 C9.2
N$15
  Top 0.254: C9.1 37.39,122.95 37.27,123.06 U4.1
N$16
  Top 0.254: U4.4 41.08,123.24 41.61,122.71 C10.1
N$17
  Top 0.254: U4.5 42.35,123.36 43,122.71 43,122.27 43.51,121.76 C10.2
N$18  (via drill 0.35)
  Top 0.254: v36.01,122.49 36.01,121.48 C11.2 | v37.15,127.44 37.27,127.56 U4.16
  Bottom 0.254: v36.01,122.49 37.03,123.51 37.03,127.32 v37.15,127.44
N$19
  Top 0.254: U4.6 43.62,123.14 45.87,120.89 C12.1
N$21
  Bottom 0.508: U1.1 213.8,53.7 216.17,51.33 USB2RS1.2
N$22
  Bottom 0.508: U1.2 212.07,52.43 215.57,48.93 USB2RS1.3
N$23
  Bottom 0.508: U1.3 211.34,51.16 215.5,47 215.5,37.5 217.87,35.13 USB2RS2.2
N$24
  Bottom 0.508: U1.4 210.61,49.89 214,46.5 214,35.5 216.77,32.73 USB2RS2.3
N$25
  Bottom 0.508: U1.5 209.88,48.62 212.5,46 212.5,23 216.5,19 USB2RS3.2
N$26
  Bottom 0.508: USB2RS3.3 215.9,16.6 211,21.5 211,46 209.65,47.35 U1.6
N$27
  Top 0.254: U5.4 29.34,123.49 26.33,120.48 C16.1
N$29
  Top 0.2: C17.2 97.41,30.71 100.06,28.06 U6.3
N$30
  Top 0.2: C17.1 97.67,32.61 99.67,30.6 U6.1
N$31
  Top 0.2: C18.1 98.11,28.61 99.93,26.79 U6.4
N$32
  Top 0.2: C18.2 98.23,26.71 99.42,25.52 U6.5
N$33
  Top 0.2: C19.2 105.96,30.71 U6.16
N$34
  Top 0.2: C20.1 99.32,24.61 99.67,24.25 U6.6
N$39  (via drill 0.35)
  Top 0.2: C24.1 110.16,28.86 v110.36,29.06
  Bottom 0.2: U7.4 100.44,26.79 103.63,23.6 108.58,23.6 110.36,25.38 v110.36,29.06
N$41
  Top 0.2: C25.2 80.27,30.71 82.91,28.06 U8.3
N$42
  Top 0.2: C25.1 80.91,32.61 82.91,30.6 U8.1
N$43
  Top 0.2: C26.1 80.97,28.61 82.78,26.79 U8.4
N$44
  Top 0.2: C26.2 81.34,26.71 82.55,25.5 83.89,25.5 U8.5
N$45
  Top 0.2: U8.16 91.78,30.6 C27.2
N$46
  Top 0.2: C28.1 82.3,24.61 82.66,24.25 U8.6
N$49  (via drill 0.35)
  Top 0.2: C32.1 90.95,28.66 v90.55,29.06
  Bottom 0.2: U9.4 83.42,26.79 86.71,23.5 89.06,23.5 90.55,25 v90.55,29.06
N$51
  Top 0.2: C33.2 66.03,28.06 U10.3
N$52
  Top 0.2: C33.1 63.76,32.61 65.79,30.58 66.89,30.58 U10.1
N$53
  Top 0.2: C34.1 64.08,28.61 65.89,26.79 U10.4
N$54
  Bottom 0.406: U1.14 198.37,51.16 196.84,52.7 C4.1
N$55
  Top 0.254: U3.14 47.91,47.31 46.99,48.24 46.99,53.46 47.64,54.12 C8.1
N$56
  Top 0.2: C34.2 64.58,26.71 65.79,25.5 66.89,25.5 U10.5
N$57
  Top 0.2: U10.16 74.78,30.6 C35.2
N$58
  Top 0.2: C36.1 63.74,24.25 U10.6
N$61
  Top 0.254: C6.1 62.38,54.18 63.75,52.81 63.75,48.24 62.9,47.38 U2.14
N$62  (via drill 0.35)
  Top 0.2: v73.53,28.8 73.74,28.6 C40.1
  Bottom 0.2: U11.4 66.53,26.79 69.79,23.54 72.2,23.54 73.53,24.87 v73.53,28.8
N$64
  Top 0.2: C41.2 49.03,28.06 U12.3
N$65
  Top 0.2: C41.1 46.87,32.61 48.87,30.6 U12.1
N$66
  Top 0.2: C42.1 46.8,28.61 48.62,26.79 U12.4
N$67
  Top 0.2: C42.2 47.44,26.71 48.64,25.5 49.76,25.5 U12.5
N$68
  Top 0.2: U12.16 57.78,30.6 C43.2
N$69
  Top 0.2: C44.1 46.74,24.25 U12.6
N$72  (via drill 0.35)
  Top 0.2: v56.39,28.93 57.74,28.93 C48.1
  Bottom 0.2: U13.4 49.51,26.79 52.83,23.47 54.99,23.47 56.39,24.87 v56.39,28.93
RH-1
  Top 0.254: U4.12 42.35,127.06 41.72,126.42 25.46,126.42 24.45,125.41 24.45,123.3 25.39,122.36 26.99,122.36 28.07,123.44 U5.3
RH-2  (via drill 0.35)
  Top 0.2: U6.12 105.83,25.5 v103.63,25.5
  Bottom 0.2: U7.3 101.07,28.06 v103.63,25.5
RH-3  (via drill 0.35)
  Top 0.2: U8.12 86.76,25.52 v86.74,25.5
  Bottom 0.2: v86.74,25.5 84.18,28.06 U9.3
RH-4  (via drill 0.35)
  Top 0.2: U10.12 69.52,25.52 v69.38,25.66
  Bottom 0.2: v69.38,25.66 66.98,28.06 U11.3
RH-5  (via drill 0.35)
  Top 0.2: U12.12 54.71,25.5 v52.45,25.5
  Bottom 0.2: v52.45,25.5 49.89,28.06 U13.3
RSA-1
  Top 0.508: USB2RS5.A 209.15,68.07 217.05,60.18 221.4,60.18 230.03,68.81 X1.2
RSA-2
  Top 0.508: USB2RS1.A 211.09,51.93 216.03,56.87 223.65,56.87 227.41,53.11 X2.2
RSA-3
  Top 0.508: USB2RS2.A 209.74,35.73 217.3,28.17 223.65,28.17 225.17,29.7 225.17,34.29 227.02,36.14 X3.2
RSA-4
  Top 0.508: USB2RS3.A 211.78,19.6 216.54,24.36 223.43,24.36 228.62,19.17 X4.2
RSB-1
  Top 0.508: USB2RS5.B 211.16,64.47 216.48,59.16 222.97,59.16 228.81,65 X1.1
RSB-2
  Top 0.508: X2.1 227.65,48.03 225.68,50 225.68,53.32 223.14,55.86 216.54,55.86 209.01,48.33 USB2RS1.B
RSB-3
  Top 0.508: USB2RS2.B 187.95,26.9 224.41,26.9 228.57,31.06 X3.1
RSB-4
  Top 0.508: USB2RS3.B 209.96,16 217.05,23.09 223.17,23.09 224.69,21.57 224.69,17.78 228.38,14.09 X4.1
RX232-1  (via drill 0.35)
  Top 0.254: U4.14 39.81,130.24 36.75,133.3 J5.4 | v44.45,85.45 R3.2
  Bottom 0.254: J5.4 36.75,131.88 44.45,124.18 v44.45,85.45
RX232-2
  Top 0.2: J1.A4 96.03,14.25 104.84,14.25 107.77,17.19 107.77,26.95 106.66,28.06 U6.14
RX232-3
  Top 0.2: U8.14 89.94,28.06 90.73,27.28 90.73,17.16 87.82,14.25 80.28,14.25 J1.B4
RX232-4
  Top 0.2: J1.C4 64.6,14.33 71.25,14.33 73.83,16.91 73.83,27.12 72.88,28.06 U10.14
RX232-5
  Top 0.2: J1.D4 48.9,14.38 55.17,14.38 56.64,15.85 56.64,27.54 56.11,28.06 U12.14
TH-1
  Top 0.254: U5.2 26.8,124.45 28.26,125.91 42.74,125.91 43.62,126.8 U4.11
TH-2  (via drill 0.35)
  Top 0.2: U6.11 104.37,24.25 v104.27,24.36
  Bottom 0.2: v104.27,24.36 104.39,24.49 104.39,26.39 101.45,29.33 U7.2
TH-3  (via drill 0.35)
  Top 0.2: v87.25,24.23 88.83,24.23 U8.11
  Bottom 0.2: U9.2 84.18,29.33 87.47,26.04 87.47,24.46 v87.25,24.23
TH-4  (via drill 0.35)
  Top 0.2: v70.1,24.36 71.75,24.36 U10.11
  Bottom 0.2: v70.1,24.36 70.1,25.35 70.11,25.36 70.11,25.96 66.74,29.33 U11.2
TH-5  (via drill 0.35)
  Top 0.2: v53.21,24.36 53.32,24.25 U12.11
  Bottom 0.2: v53.21,24.36 53.21,26.03 49.91,29.33 U13.2
TX232-1  (via drill 0.35)
  Top 0.254: U4.13 41.08,130.49 38.03,133.54 38.03,135.3 36.3,137.03 J5.5 | R2.2 43.69,95.35 v43.56,95.48
  Bottom 0.254: v43.56,95.48 43.56,123.8 35.48,131.88 J5.5
TX232-2
  Top 0.2: J1.A5 90.68,7.64 89.66,6.62 88.19,6.62 86.33,8.48 86.33,10.36 90.68,14.71 104.65,14.71 107.31,17.38 107.31,26.27 106.79,26.79 U6.13
TX232-3
  Top 0.2: J1.B5 74.93,7.38 74.25,6.7 72.36,6.7 70.36,8.7 70.36,10.39 74.68,14.71 87.63,14.71 90.19,17.27 90.19,26.37 89.77,26.79 U8.13
TX232-4
  Top 0.2: U10.13 72.84,26.79 73.37,26.27 73.37,17.09 71.06,14.78 58.87,14.78 54.69,10.59 54.69,8.16 55.98,6.87 58.42,6.87 59.18,7.64 J1.C5
TX232-5
  Top 0.2: J1.D5 43.43,7.72 42.67,6.96 40.63,6.96 39.05,8.54 39.05,10.96 42.93,14.84 54.98,14.84 56.19,16.04 56.19,26.52 55.91,26.79 U12.13
UN1  (via drill 0.35)
  Top 0.254: U2.1 56.99,49.92 58.8,48.11 58.8,38.08 59.69,37.18 79.77,37.18 81.17,35.79 v94.49,35.79
  Bottom 0.254: U7.6 97.26,24.25 96.39,25.12 96.39,28.63 94.49,30.54 v94.49,35.79
UN2  (via drill 0.35)
  Top 0.254: U2.3 56.61,47.38 57.78,46.2 57.78,36.93 59.18,35.54 78.49,35.54 v78.87,35.92
  Bottom 0.254: v78.87,35.92 78.87,29.27 79.38,28.76 79.38,25.12 80.24,24.25 U9.6
UN3  (via drill 0.35)
  Top 0.254: v55.88,44.55 55.59,44.84 U2.5
  Bottom 0.254: U11.6 63.61,24.25 62.87,25 62.87,28.33 55.63,35.57 55.63,44.3 v55.88,44.55
UN4  (via drill 0.35)
  Top 0.254: v44.58,49.76 42.62,49.76 U3.1
  Bottom 0.254: U13.6 46.84,24.25 45.85,25.25 45.85,28.63 44.58,29.9 v44.58,49.76
UN5  (via drill 0.35)
  Top 0.254: U5.6 31.88,122.28 v31.75,122.15 | v40.64,47.47 40.8,47.31 U3.3
  Bottom 0.254: v31.75,122.15 40.64,113.26 v40.64,47.47
UP1  (via drill 0.35)
  Top 0.254: U2.2 56.73,48.65 58.29,47.09 58.29,37.31 58.93,36.68 79.56,36.68 81.21,35.02 v96.01,35.02
  Bottom 0.254: U7.5 97.64,25.52 96.9,26.27 96.9,28.84 96.01,29.73 v96.01,35.02
UP2  (via drill 0.35)
  Top 0.254: U2.4 56.35,46.11 57.15,45.31 57.15,36.68 58.8,35.03 v80.14,35.03
  Bottom 0.254: v80.14,35.03 80.14,26.14 80.75,25.52 U9.5
UP3  (via drill 0.35)
  Top 0.254: U2.6 55.34,43.57 56.38,42.52 v56.38,41.51
  Bottom 0.254: v56.38,41.51 56.38,35.53 63.37,28.54 63.37,26.01 63.86,25.52 U11.5
UP4  (via drill 0.35)
  Top 0.254: U3.2 45.24,48.59 v45.34,48.49
  Bottom 0.254: v45.34,48.49 45.34,29.86 46.35,28.84 46.35,26.14 46.97,25.52 U13.5
UP5  (via drill 0.35)
  Top 0.254: v39.62,46.46 40.04,46.05 U3.4 | v30.48,122.15 30.61,122.28 U5.5
  Bottom 0.254: v30.48,122.15 39.62,113.01 v39.62,46.46
VCC
  Bottom 0.508: U1.13 197.1,49.89 195.2,51.79 195.2,58.55 | 222.13,54.33 222.13,68.42 USB2RS5.1 215.28,70.07 209.08,76.27 X7.1 209.08,80.36 208.19,81.26 193.96,81.26 192.81,80.1 X5.1 192.81,59.91 193.68,59.04 193.69,59.05 194.69,59.05 | 222.13,54.33 221.73,53.93 USB2RS1.1 221.76,53.93 222.13,53.57 | 222.13,53.57 222.13,38.08 | 222.13,38.08 221.78,37.73 USB2RS2.1 221.71,37.73 222.13,37.32 | 222.13,37.32 222.13,22.08 221.65,21.6 USB2RS3.1 | 222.13,54.33 222.13,53.57 | 222.13,38.08 222.13,37.32 | C3.1 195.71,59.05 | 195.71,59.05 194.69,59.05 | 194.69,59.05 195.2,58.55 | 195.2,58.55 195.71,59.05

### Text on the board
tPlace: A+ | B- | A+ | B- | A+ | B- | A+ | B-
tNames: PWR | TX | RX | 1 | 2 | GND | D+ | D- | +5v | GND | D+ | D- | +5v